# EAGLE design il-serbatoio (EAGLE 8.1.0)
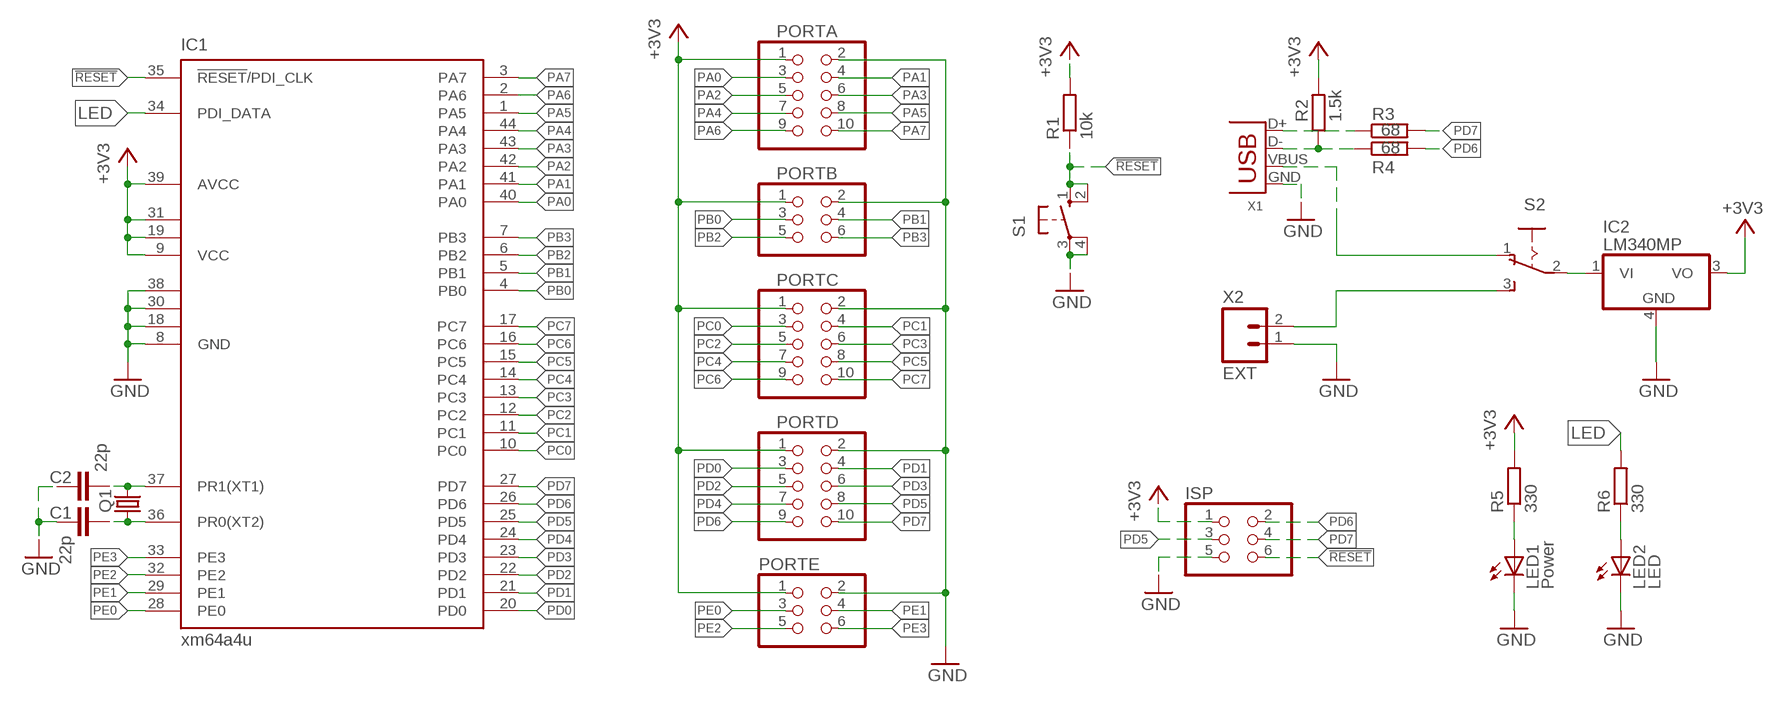
[diagram p0: schematic, sheet 1]

## Parts
C1  22p  C-EU025-024X044  [C025-024X044]
C2  22p  C-EU025-024X044  [C025-024X044]
IC1  xm64a4u  XMEGA16A4A  [TQFP44]
IC2  LM340MP  LM340MP-05  [SOT223]
ISP  PINHD-2X3  [2X03]
LED1  Power  LEDCHIP-LED0805  [CHIP-LED0805]
LED2  LED  LEDCHIP-LED0805  [CHIP-LED0805]
PORTA  PINHD-2X5  [2X05]
PORTB  PINHD-2X3  [2X03]
PORTC  PINHD-2X5  [2X05]
PORTD  PINHD-2X5  [2X05]
PORTE  PINHD-2X3  [2X03]
Q1  CRYSTALCTS406  [CTS406]
R1  10k  R-EU_M0805  [M0805]
R2  1.5k  R-EU_M0805  [M0805]
R3  68  R-EU_M0805  [M0805]
R4  68  R-EU_M0805  [M0805]
R5  330  R-EU_M0805  [M0805]
R6  330  R-EU_M0805  [M0805]
S1  10-XX  [B3F-10XX]
S2  255SB  [255SB]
X1  USB-MB-S  [USB-MB-S]
X2  EXT  JST-22MM-PTH-VERT-LOCK  [JST-2-2MM-PTH-VERT-LOCK]

## Nets
!RESET: IC1.35(!RESET!/PDI_CLK) ISP.6 R1.1 S1.1(S) S1.2(S1)
+3V3: IC1.9(VCC) IC1.19(VCC1) IC1.31(VCC2) IC1.39(AVCC) IC2.3(VO) ISP.1 PORTA.1 PORTB.1 PORTC.1 PORTD.1 PORTE.1 R1.2 R2.2 R5.2
GND: C1.1 C2.1 IC1.8(GND) IC1.18(GND1) IC1.30(GND2) IC1.38(GND3) IC2.4(GND) ISP.5 LED1.C LED2.C PORTA.2 PORTB.2 PORTC.2 PORTD.2 PORTE.2 S1.3(P) S1.4(P1) X1.GND X2.1
LED: IC1.34(PDI_DATA) R6.2
N$1: S2.3(S) X2.2
N$2: S2.1(O) X1.VBUS
N$3: R2.1 R4.1 X1.D-
N$4: R3.1 X1.D+
N$5: IC2.1(VI) S2.2(P)
N$8: LED1.A R5.1
N$9: LED2.A R6.1
N$23: C1.2 IC1.36(PR0(XT2)) Q1.1
N$24: C2.2 IC1.37(PR1(XT1)) Q1.3
PA0: IC1.40(PA0) PORTA.3
PA1: IC1.41(PA1) PORTA.4
PA2: IC1.42(PA2) PORTA.5
PA3: IC1.43(PA3) PORTA.6
PA4: IC1.44(PA4) PORTA.7
PA5: IC1.1(PA5) PORTA.8
PA6: IC1.2(PA6) PORTA.9
PA7: IC1.3(PA7) PORTA.10
PB0: IC1.4(PB0) PORTB.3
PB1: IC1.5(PB1) PORTB.4
PB2: IC1.6(PB2) PORTB.5
PB3: IC1.7(PB3) PORTB.6
PC0: IC1.10(PC0) PORTC.3
PC1: IC1.11(PC1) PORTC.4
PC2: IC1.12(PC2) PORTC.5
PC3: IC1.13(PC3) PORTC.6
PC4: IC1.14(PC4) PORTC.7
PC5: IC1.15(PC5) PORTC.8
PC6: IC1.16(PC6) PORTC.9
PC7: IC1.17(PC7) PORTC.10
PD0: IC1.20(PD0) PORTD.3
PD1: IC1.21(PD1) PORTD.4
PD2: IC1.22(PD2) PORTD.5
PD3: IC1.23(PD3) PORTD.6
PD4: IC1.24(PD4) PORTD.7
PD5: IC1.25(PD5) ISP.3 PORTD.8
PD6: IC1.26(PD6) ISP.2 PORTD.9 R4.2
PD7: IC1.27(PD7) ISP.4 PORTD.10 R3.2
PE0: IC1.28(PE0) PORTE.3
PE1: IC1.29(PE1) PORTE.4
PE2: IC1.32(PE2) PORTE.5
PE3: IC1.33(PE3) PORTE.6

## Library data of the parts
C1 C2 = resistor:C-EU: CAPACITOR, European symbol
IC1 = atmel:XMEGA16A4: MICROCONTROLLER Features High-performance, Low-power 8/16-bit AVR XMEGA Microcontroller Non-Volatile Program and Data Memories - 16 KB - 128 KB of In-System Self-Programmable Flash - 4 KB - 8 KB Boot Code Section with Independent Lock Bits - 1 KB - 2 KB EEPROM - 2 KB - 8 KB Internal SRAM Peripheral Features - Four-channel DMA Controller with support for external requests - Eight-channel Event System - Five 16-bit Timer/Counters Three Timer/Counters with 4 Output Compare or Input Capture channels Two Timer/Counters with 2 Output Compare or Input Capture channels High-Resolution Extensions on all Timer/Counters Advanced Waveform Extension on one Timer/Counter - Five USARTs IrDA Extension on one USART - Two Two-Wire Interfaces with dual address match (I2C and SMBus compatible) - Two SPIs (Serial Peripheral Interfaces) peripherals - AES and DES Crypto Engine - 16-bit Real Time Counter with Separate Oscillator - One Twelve-channel, 12-bit, 2 Msps Analog to Digital Converter - One Two-channel, 12-bit, 1 Msps Digital to Analog Converter - Two Analog Comparators with Window compare function - External Interrupts on all General Purpose I/O pins - Programmable Watchdog Timer with Separate On-chip Ultra Low Power Oscillator Special Microcontroller Features - Power-on Reset and Programmable Brown-out Detection - Internal and External Clock Options with PLL - Programmable Multi-level Interrupt Controller - Sleep Modes: Idle, Power-down, Standby, Power-save, Extended Standby - Advanced Programming, Test and Debugging Interfaces PDI (Program and Debug Interface) for programming, test and debugging I/O and Packages - 34 Programmable I/O Lines - 44 - lead TQFP - 44 - pad VQFN/QFN - 49 - ball VFBGA Operating Voltage - 1.6 - 3.6V Speed performance - 0 - 12 MHz @ 1.6 - 3.6V - 0 - 32 MHz @ 2.7 - 3.6V Drawn by Dipl.-Ing. (FH) Robert Siegler Created: 27.05.09; OC_FARNELL: unknown; OC_NEWARK: unknown
IC2 = linear:LM340?-*: Positive VOLTAGE REGULATOR Source: http://cache.national.com/ds/LM/LM340.pdf
ISP PORTB PORTE = pinhead:PINHD-2X3: PIN HEADER
LED1 LED2 = led:LED: LED OSRAM: - CHIPLED LG R971, LG N971, LY N971, LG Q971, LY Q971, LO R971, LY R971 LH N974, LH R974 LS Q976, LO Q976, LY Q976 LO Q996 - Hyper CHIPLED LW Q18S LB Q993, LB Q99A, LB R99A - SideLED LS A670, LO A670, LY A670, LG A670, LP A670 LB A673, LV A673, LT A673, LW A673 LH A674 LY A675 LS A676, LA A676, LO A676, LY A676, LW A676 LS A679, LY A679, LG A679 - Hyper Micro SIDELED® LS Y876, LA Y876, LO Y876, LY Y876 LT Y87S - SmartLED LW L88C, LW L88S LB L89C, LB L89S, LG L890 LS L89K, LO L89K, LY L89K LS L896, LA L896, LO L896, LY L896 - TOPLED LS T670, LO T670, LY T670, LG T670, LP T670 LSG T670, LSP T670, LSY T670, LOP T670, LYG T670 LG T671, LOG T671, LSG T671 LB T673, LV T673, LT T673, LW T673 LH T674 LS T676, LA T676, LO T676, LY T676, LB T676, LH T676, LSB T676, LW T676 LB T67C, LV T67C, LT T67C, LS T67K, LO T67K, LY T67K, LW E67C LS E67B, LA E67B, LO E67B, LY E67B, LB E67C, LV E67C, LT E67C LW T67C LS T679, LY T679, LG T679 LS T770, LO T770, LY T770, LG T770, LP T770 LB T773, LV T773, LT T773, LW T773 LH T774 LS E675, LA E675, LY E675, LS T675 LS T776, LA T776, LO T776, LY T776, LB T776 LHGB T686 LT T68C, LB T68C - Hyper Mini TOPLED® LB M676 - Mini TOPLED Santana® LG M470 LS M47K, LO M47K, LY M47K Source: http://www.osram.convergy.de LUXEON: - LUMILED® LXK2-PW12-R00, LXK2-PW12-S00, LXK2-PW14-U00, LXK2-PW14-V00 LXK2-PM12-R00, LXK2-PM12-S00, LXK2-PM14-U00 LXK2-PE12-Q00, LXK2-PE12-R00, LXK2-PE12-S00, LXK2-PE14-T00, LXK2-PE14-U00 LXK2-PB12-K00, LXK2-PB12-L00, LXK2-PB12-M00, LXK2-PB14-N00, LXK2-PB14-P00, LXK2-PB14-Q00 LXK2-PR12-L00, LXK2-PR12-M00, LXK2-PR14-Q00, LXK2-PR14-R00 LXK2-PD12-Q00, LXK2-PD12-R00, LXK2-PD12-S00 LXK2-PH12-R00, LXK2-PH12-S00 LXK2-PL12-P00, LXK2-PL12-Q00, LXK2-PL12-R00 Source: www.luxeon.com KINGBRIGHT: KA-3528ASYC Source: www.kingbright.com
PORTA PORTC PORTD = pinhead:PINHD-2X5: PIN HEADER
Q1 = adafruit:CRYSTAL: CRYSTAL; OC_FARNELL: unknown; OC_NEWARK: unknown
R1-R6 = resistor:R-EU_: RESISTOR, European symbol
S1 = switch-omron:10-XX: OMRON SWITCH; MPN: B3F-1000; OC_FARNELL: 176432; OC_NEWARK: 36M3542
S2 = switch:255SB: SLIDING SWITCH Distributor Buerklin, 11G810
X1 = con-usb-3:USB: USB Connectors
X2 = Connectors:JST-2

## Board
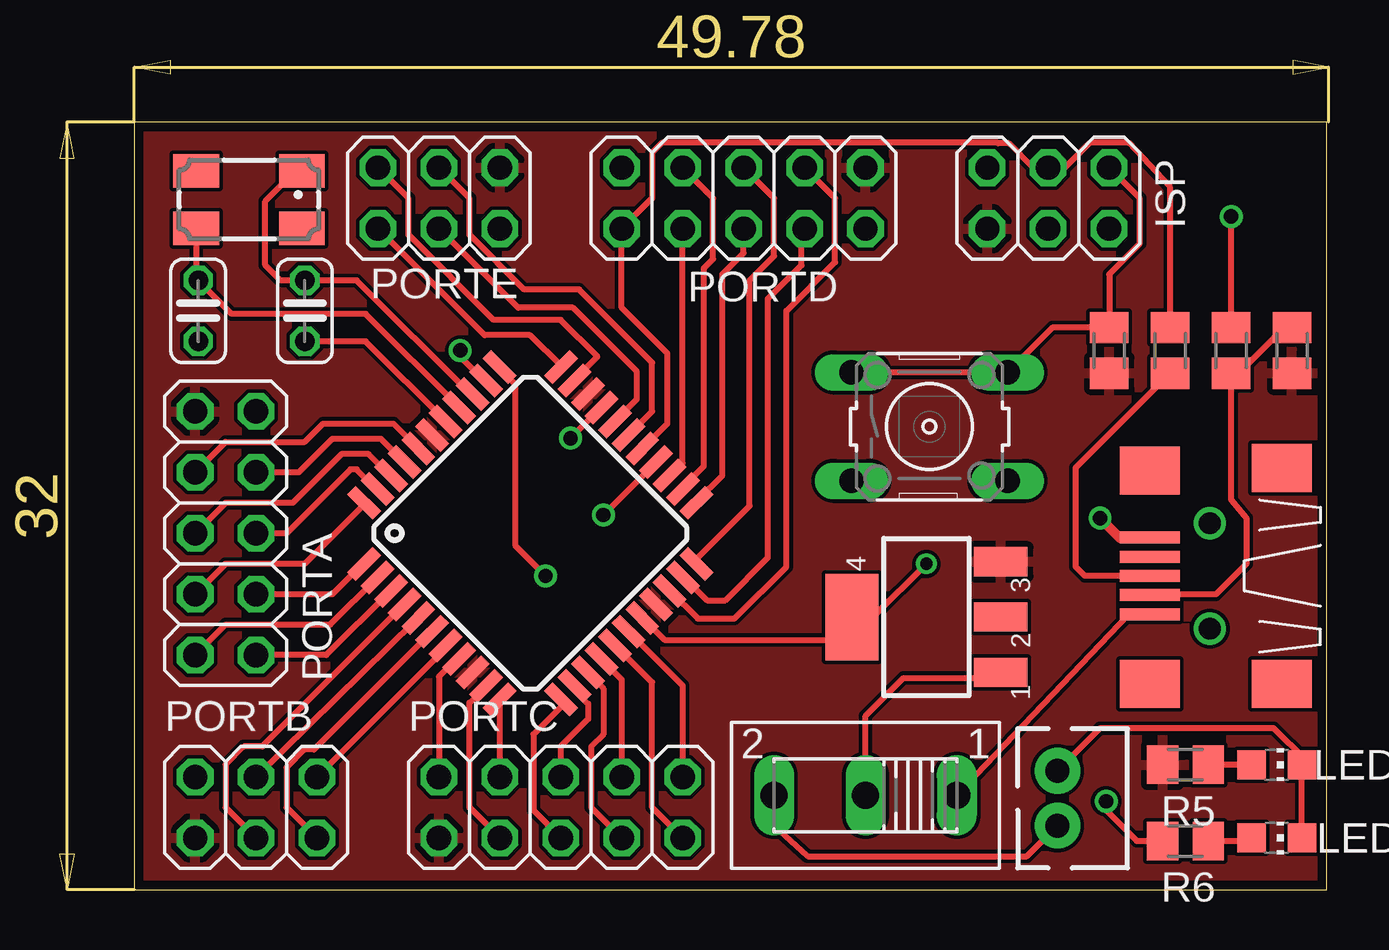
[diagram p1: board, top side]
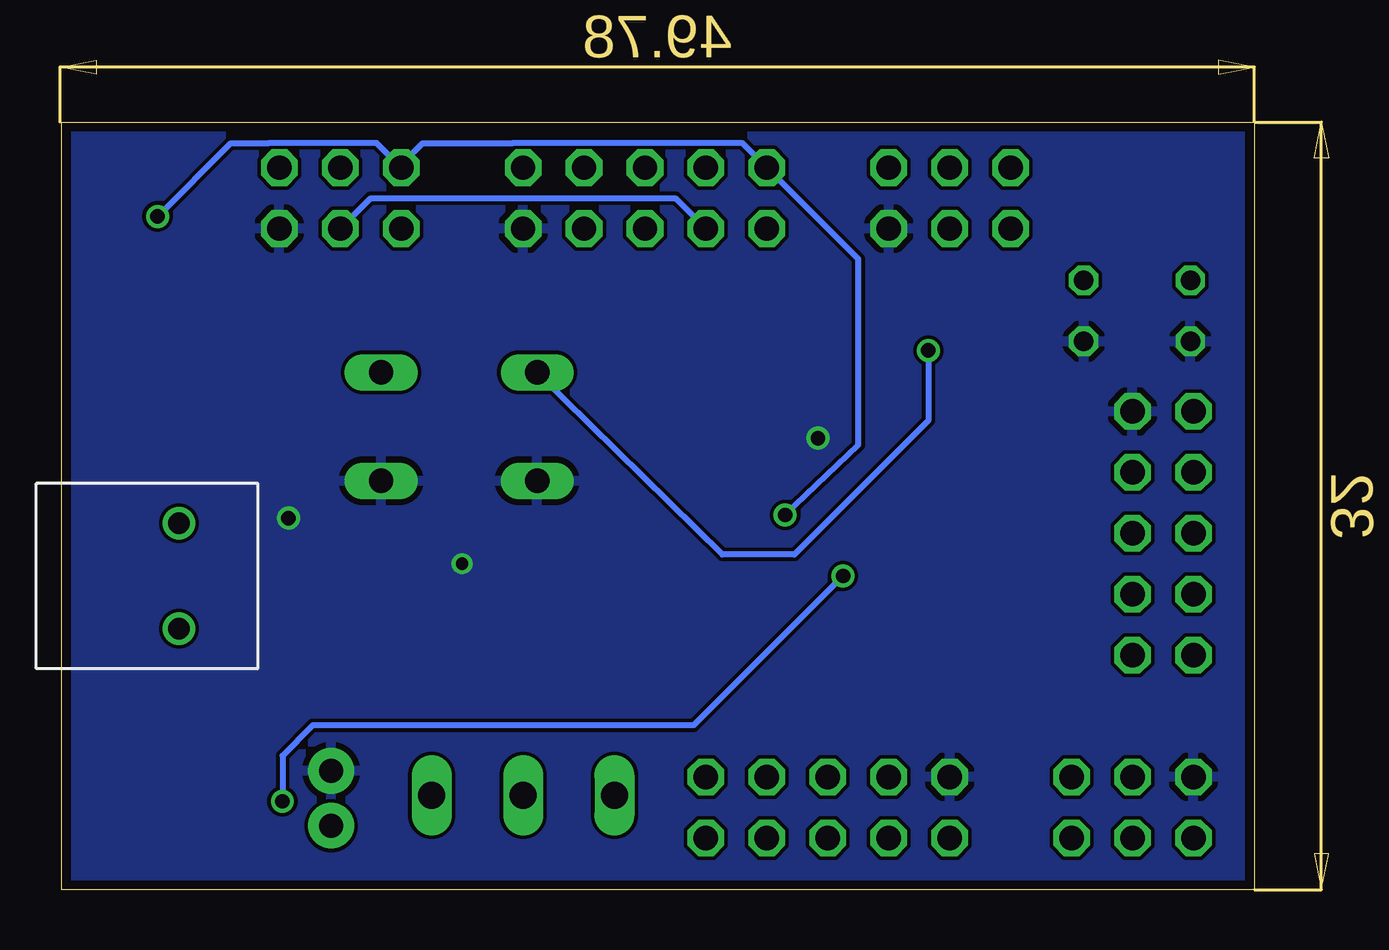
[diagram p2: board, bottom side, seen from below]

Size 49.71 x 31.99 mm. Coordinates in mm from the lower left corner, seen from the top.
Outline: 0,0 49.71,0 49.71,31.99 0,31.99 0,0
Copper layers (1*16): Top 0.0356mm / dielectric 1.5011mm / Bottom 0.0356mm
Design rules "LaenPCBOrder": minimum track width 6mil, minimum drill 13mil, track to track 6mil, track to pad 6mil, pad to pad 6mil, via to via 6mil, smd to smd 6mil, copper to edge 15mil, drill to drill 6mil, minimum pad ring 7mil, minimum via ring 7mil, stop-mask expansion 3mil, vias tented up to drill 0mil, thermal gap 10mil

### Footprints (pad centres in the part's own frame; a part is rotated, then mirrored left to right if it is on the bottom)
C025-024X044 = drill 0.813 octagon: 1 -1.27,0; 2 1.27,0
TQFP44 = smd 1.5 x 0.5: 1 -5.8,4; 2 -5.8,3.2; 3 -5.8,2.4; 4 -5.8,1.6; 5 -5.8,0.8; 6 -5.8,0; 7 -5.8,-0.8; 8 -5.8,-1.6; 9 -5.8,-2.4; 10 -5.8,-3.2; 11 -5.8,-4; 23 5.8,-4; 24 5.8,-3.2; 25 5.8,-2.4; 26 5.8,-1.6; 27 5.8,-0.8; 28 5.8,0; 29 5.8,0.8; 30 5.8,1.6; 31 5.8,2.4; 32 5.8,3.2; 33 5.8,4 | smd 0.5 x 1.5: 12 -4,-5.8; 13 -3.2,-5.8; 14 -2.4,-5.8; 15 -1.6,-5.8; 16 -0.8,-5.8; 17 0,-5.8; 18 0.8,-5.8; 19 1.6,-5.8; 20 2.4,-5.8; 21 3.2,-5.8; 22 4,-5.8; 34 4,5.8; 35 3.2,5.8; 36 2.4,5.8; 37 1.6,5.8; 38 0.8,5.8; 39 0,5.8; 40 -0.8,5.8; 41 -1.6,5.8; 42 -2.4,5.8; 43 -3.2,5.8; 44 -4,5.8
SOT223 = smd 1.219 x 2.235: 1 -2.311,-3.099; 2 0,-3.099; 3 2.311,-3.099 | smd 3.6 x 2.2: 4 0,3.099
2X03 = drill 1.016 octagon: 1 -2.54,-1.27; 2 -2.54,1.27; 3 0,-1.27; 4 0,1.27; 5 2.54,-1.27; 6 2.54,1.27
CHIP-LED0805 = smd 1.2 x 1.2: A 0,-1.05; C 0,1.05
2X05 = drill 1.016 octagon: 1 -5.08,-1.27; 2 -5.08,1.27; 3 -2.54,-1.27; 4 -2.54,1.27; 5 0,-1.27; 6 0,1.27; 7 2.54,-1.27; 8 2.54,1.27; 9 5.08,-1.27; 10 5.08,1.27
CTS406 = smd 1.9 x 1.4: 1 -2.2,-1.2; 2 2.2,-1.2; 3 2.2,1.2; 4 -2.2,1.2
M0805 = smd 1.3 x 1.6: 1 -0.95,0; 2 0.95,0
B3F-10XX = drill 1.016 long: 1 -3.251,2.261; 2 3.251,2.261; 3 -3.251,-2.261; 4 3.251,-2.261
255SB = drill 1.118 long: 1 -3.81,0; 2 0,0; 3 3.81,0
USB-MB-S = smd 2.5 x 0.5: D+ 2.5,0; D- 2.5,0.8; GND 2.5,-1.6; ID 2.5,-0.8; VBUS 2.5,1.6 | smd 2.5 x 2: P$1 -3,-4.5; P$2 -3,4.5; P$3 2.5,-4.4; P$4 2.5,4.5 | drill 0.9: P$5 0,2.2; P$6 0,-2.2
JST-2-2MM-PTH-VERT-LOCK = drill 1 pad 1.9: 1 -1.143,0; 2 1.143,0

### Placement (x,y rotation side)
C1  7.11,24.13 90 top
C2  2.67,24.13 90 top
IC1  16.51,14.86 45 top
IC2  33.02,11.37 90 top
ISP  38.1,28.83 0 top
LED1  47.62,5.21 270 top
LED2  47.62,2.16 270 top
PORTA  3.81,14.86 270 top
PORTB  5.08,3.43 0 top
PORTC  17.78,3.43 0 top
PORTD  25.4,28.83 180 top
PORTE  12.7,28.83 180 top
Q1  4.79,28.77 180 top
R1  40.64,22.48 270 top
R2  48.26,22.48 270 top
R3  43.18,22.48 90 top
R4  45.72,22.48 90 top
R5  43.81,5.21 180 top
R6  43.81,2.03 180 top
S1  33.15,19.3 0 top
S2  30.48,3.94 180 top
X1  44.83,13.08 180 top
X2  38.48,3.81 270 top

### Tracks (layer width: path | path; a pad name or v marks a point on that pad's centre or on a via)
!RESET  (via drill 0.6)
  Top 0.254: S1.1 S1.2 38.26,23.43 R1.1 40.64,25.65 41.91,26.92 41.91,28.83 ISP.6 | IC1.35 14.59,21.22 13.46,22.35 v13.59,22.48
  Bottom 0.254: v13.59,22.48 13.59,19.56 19.18,13.97 22.17,13.97 S1.1
+3V3
  pour Top: 0,0 0,32 49.78,32 49.78,0
GND  (via drill 0.51, 0.6)
  Top 0.254: v33.02,13.59 30.8,11.37 IC2.4 29.34,10.78 29.34,10.29 29.21,10.41 22.1,10.41 IC1.18 | IC1.38 9.65,22.86 C1.1 | IC1.8 13.44,9.63 12.7,8.89 PORTC.2 | IC1.30 19.46,20.09 v18.19,18.82 | LED2.C LED1.C 48.8,5.43 47.5,6.73 40.26,6.73 X2.1
  Top 0.406: X1.GND 41.07,14.68 v40.26,15.49
  Bottom 0.254: v18.19,18.82 18.16,18.8
  pour Bottom: 0,0 0,32 49.78,32 49.78,0
LED  (via drill 0.6)
  Top 0.254: IC1.34 15.24,21.72 15.88,21.08 15.88,14.35 v17.14,13.08 | v40.51,3.68 40.51,3.3 41.78,2.03 R6.2
  Bottom 0.254: v17.14,13.08 23.37,6.86 39.24,6.86 40.51,5.59 v40.51,3.68
N$1
  Top 0.254: S2.3 26.67,2.67 28.07,1.4 37.21,1.4 X2.2
N$2
  Top 0.254: X1.VBUS 41.45,11.48 S2.1
N$3
  Top 0.254: X1.D- 42.62,12.32 45.09,12.32 46.35,13.59 46.35,15.49 45.72,16.26 R4.1 46.04,21.53 47.62,23.11 47.95,23.11 R2.1
N$4
  Top 0.254: X1.D+ 39.62,13.08 39.24,13.46 39.24,17.59 R3.1
N$5
  Top 0.254: S2.2 30.48,7.24 32.07,8.83 35.89,8.83 IC2.1
N$8
  Top 0.254: LED1.A R5.1
N$9
  Top 0.254: R6.1 46.58,2.03 LED2.A
N$23
  Top 0.254: Q1.1 6.6,29.59 6.35,29.59 5.46,28.7 5.46,26.04 6.1,25.4 C1.2 9.27,25.4 14.01,20.66 IC1.36
N$24
  Top 0.254: Q1.3 2.58,25.48 C2.2 4.06,24 9.65,24 13.54,20.11 IC1.37
PA0
  Top 0.254: PORTA.3 3.81,18.67 7.11,18.67 7.87,19.43 10.81,19.43 IC1.40
PA1
  Top 0.254: IC1.41 11.25,17.83 10.29,18.8 8.26,18.8 6.86,17.4 PORTA.4
PA2
  Top 0.254: IC1.42 10.68,17.26 9.78,18.16 8.64,18.16 6.6,16.13 3.81,16.13 PORTA.5
PA3
  Top 0.254: IC1.43 10.1,16.7 9.27,17.53 9.02,17.53 6.35,14.86 PORTA.6
PA4
  Top 0.254: IC1.44 9.58,16.06 7.11,13.59 3.81,13.59 PORTA.7
PA5
  Top 0.254: IC1.1 9.52,13.59 8.26,12.32 PORTA.8
PA6
  Top 0.254: PORTA.9 3.81,11.05 8.18,11.05 IC1.2
PA7
  Top 0.254: IC1.3 10.68,12.46 8,9.78 PORTA.10
PB0
  Top 0.254: IC1.4 11.25,11.89 5.33,5.97 4.57,5.97 3.81,5.21 3.81,3.43 PORTB.3
PB1
  Top 0.254: IC1.5 11.7,11.2 PORTB.4
PB2
  Top 0.254: IC1.6 7.49,5.84 7.11,5.84 6.35,5.08 6.35,3.43 PORTB.5
PB3
  Top 0.254: IC1.7 12.97,10.05 PORTB.6
PC0
  Top 0.254: PORTC.3 13.97,3.43 13.97,7.79 IC1.10
PC1
  Top 0.254: IC1.11 PORTC.4
PC2
  Top 0.254: IC1.12 17.78,7.62 16.64,6.48 16.64,3.3 PORTC.5
PC3
  Top 0.254: IC1.13 18.35,8.32 18.92,7.75 18.92,7.11 17.78,5.97 PORTC.6
PC4
  Top 0.254: IC1.14 18.91,9.03 19.56,8.38 19.56,6.48 19.05,5.97 19.05,3.43 PORTC.7
PC5
  Top 0.254: IC1.15 19.48,9.6 20.32,8.76 PORTC.8
PC6
  Top 0.254: PORTC.9 21.59,3.43 21.59,8.65 IC1.16
PC7
  Top 0.254: IC1.17 | IC1.17 22.86,8.51 PORTC.10
PD0
  Top 0.254: IC1.20 22.34,12.46 23.5,11.3 25.02,11.3 27.18,13.46 27.18,24.13 29.21,26.16 29.21,28.83 PORTD.3
PD1
  Top 0.254: IC1.21 22.92,13.02 23.88,12.06 24.64,12.06 26.42,13.84 26.42,24.64 27.81,26.04 27.81,27.43 PORTD.4
PD2
  Top 0.254: IC1.22 23.44,13.79 25.65,16 25.65,25.4 26.67,26.42 26.67,28.83 PORTD.5
PD3
  Top 0.254: IC1.23 23.44,16.2 24.51,17.27 24.51,25.65 25.4,26.54 PORTD.6
PD4
  Top 0.254: IC1.24 22.87,16.78 23.75,17.65 23.75,25.91 24.13,26.29 24.13,28.83 PORTD.7
PD5
  Top 0.254: IC1.25 22.34,17.26 22.86,17.78 PORTD.8
  Bottom 0.254: ISP.3 36.83,28.83 24.13,28.83 PORTD.8
PD6  (via drill 0.6)
  Top 0.254: R4.2 v45.72,28.07 | IC1.26 21.74,17.81 v19.56,15.62
  Bottom 0.254: v45.72,28.07 42.67,31.11 41.1,31.11 41.07,31.14 36.6,31.14 ISP.2 35.56,30.23 34.67,31.11 30.94,31.11 30.91,31.14 21.36,31.14 PORTD.9 16.51,26.29 16.51,18.54 v19.56,15.62
PD7
  Top 0.254: R3.2 43.18,29.29 41.45,31.14 39.83,31.14 38.79,30.1 ISP.4 37.47,30.1 36.45,31.11 36.02,31.11 35.99,31.14 22,31.14 21.59,30.73 21.59,28.83 PORTD.10 20.32,24.26 22.23,22.35 22.23,19.43 IC1.27
PE0
  Top 0.254: IC1.28 21.59,19.94 21.59,21.97 18.54,25.02 16.26,25.02 13.97,27.3 13.97,28.83 PORTE.3
PE1
  Top 0.254: IC1.29 20.95,20.45 20.95,21.59 18.29,24.26 16,24.26 PORTE.4
PE2
  Top 0.254: IC1.32 18.35,21.27 19.3,22.23 17.78,23.75 14.99,23.75 11.43,27.3 11.43,28.83 PORTE.5
PE3
  Top 0.254: IC1.33 17.78,21.84 16.51,23.11 14.61,23.11 PORTE.6